# Altium project LimePSB-RPCM_1v2.PrjPcb (part 11 of 13)

## Sheet 13_Power.SchDoc: Power
size A3; Organization: Lime Microsystems; Address1: Surrey Tech Centre; Address2: Guildford GU2 7YG; Address3: Surrey; Address4: United Kingdom; Revision: v1.2; SheetNumber: 13; SheetTotal: 13
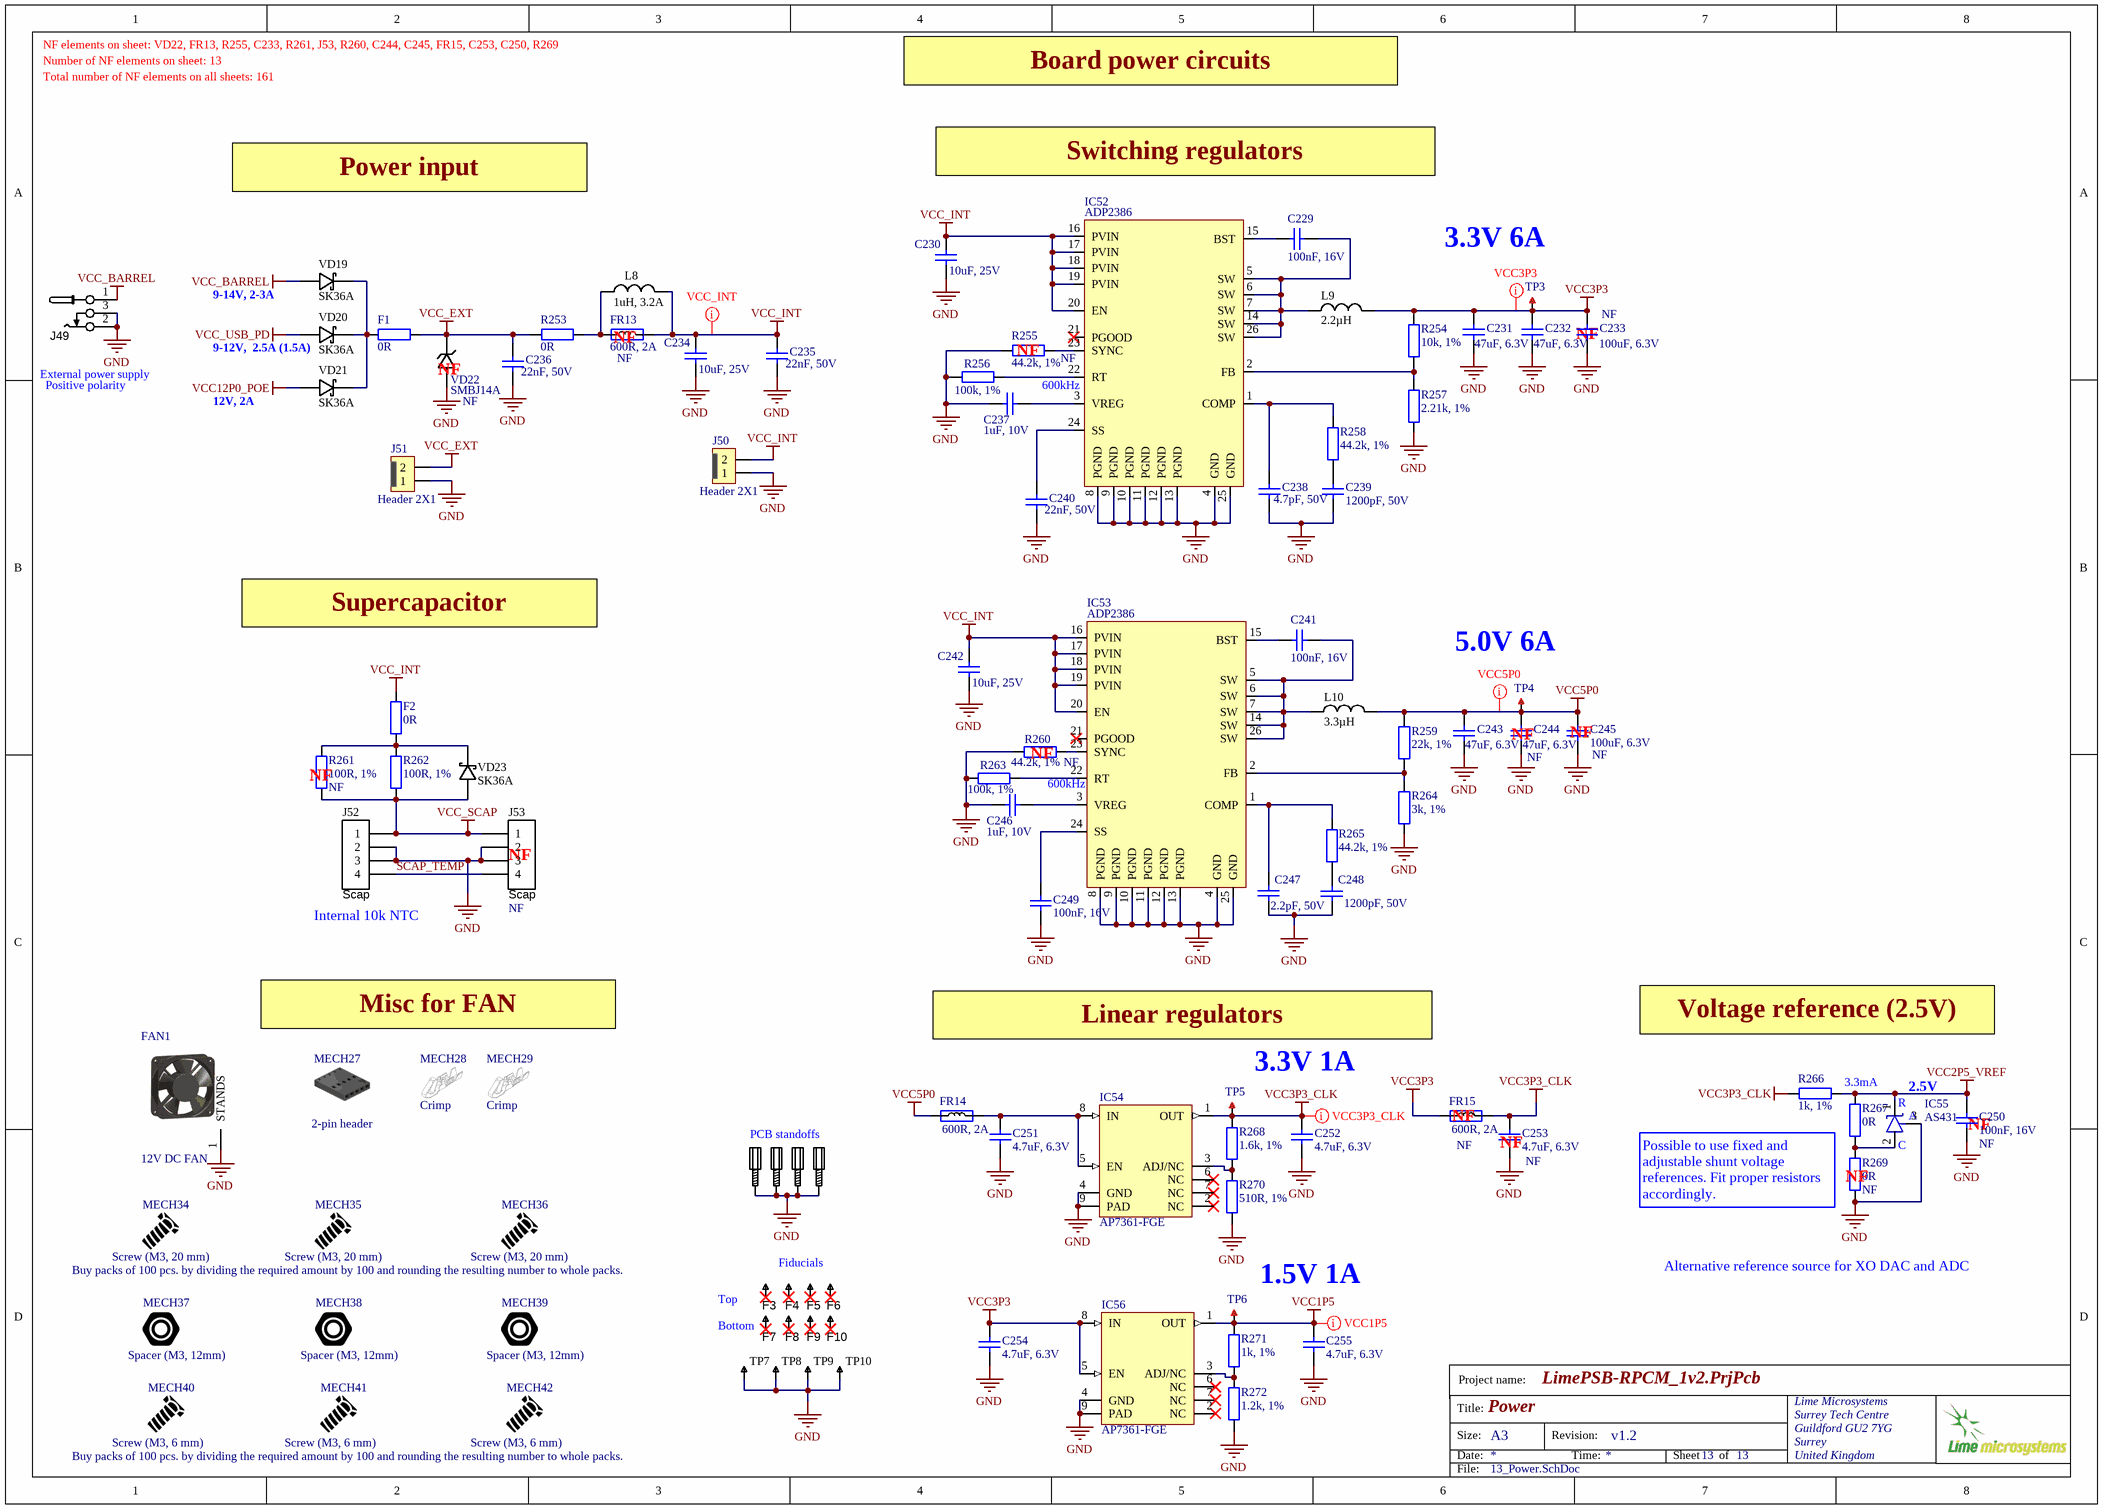
[diagram p12: 13_Power.SchDoc]

### Parts
C229  100nF, 16V  [CAP0402]
C230  10uF, 25V  [CAP0805]
C231  47uF, 6.3V  [CAP1206]
C232  47uF, 6.3V  [CAP1206]
C233  100uF, 6.3V  Assembly Info: NF  [CAP1206]
C234  10uF, 25V  [CAP0805]
C235  22nF, 50V  [CAP0402]
C236  22nF, 50V  [CAP0402]
C237  1uF, 10V  [CAP0402]
C238  4.7pF, 50V  [CAP0402]
C239  1200pF, 50V  [CAP0402]
C240  22nF, 50V  [CAP0402]
C241  100nF, 16V  [CAP0402]
C242  10uF, 25V  [CAP0805]
C243  47uF, 6.3V  [CAP1206]
C244  47uF, 6.3V  Assembly Info: NF  [CAP1206]
C245  100uF, 6.3V  Assembly Info: NF  [CAP1206]
C246  1uF, 10V  [CAP0402]
C247  2.2pF, 50V  [CAP0402]
C248  1200pF, 50V  [CAP0402]
C249  100nF, 16V  [CAP0402]
C250  100nF, 16V  Assembly Info: NF  [CAP0402]
C251  4.7uF, 6.3V  [CAP0402]
C252  4.7uF, 6.3V  [CAP0402]
C253  4.7uF, 6.3V  Assembly Info: NF  [CAP0402]
C254  4.7uF, 6.3V  [CAP0402]
C255  4.7uF, 6.3V  [CAP0402]
F1  0R  [RES0805]
F2  0R  [RES0805]
F3  Fiducial  [Fiducial]  (value not drawn)
F4  Fiducial  [Fiducial]  (value not drawn)
F5  Fiducial  [Fiducial]  (value not drawn)
F6  Fiducial  [Fiducial]  (value not drawn)
F7  Fiducial  [Fiducial]  (value not drawn)
F8  Fiducial  [Fiducial]  (value not drawn)
F9  Fiducial  [Fiducial]  (value not drawn)
F10  Fiducial  [Fiducial]  (value not drawn)
FAN1  12V DC FAN  [FAN_80mm_V1]
FR13  600R, 2A  Assembly Info: NF  [RES0805]
FR14  600R, 2A  [RES0805]
FR15  600R, 2A  Assembly Info: NF  [RES0805]
IC52  ADP2386  [ADP2386]
IC53  ADP2386  [ADP2386]
IC54  AP7361-FGE  [AP7361]
IC55  AS431  [SOT23-3_v2]
IC56  AP7361-FGE  [AP7361]
J49  CONN_PWR_JACK_2.1x5.5mm  [CONN_PWR_JACK_v2]  (value not drawn)
J50  Header 2X1  [Header1x2_TH_LOCKING]
J51  Header 2X1  [Header1x2_TH_LOCKING]
J52  Scap  [874370443_1P5_SMD_HEADER]
J53  Scap  Assembly Info: NF  [HEADER4X1_TH]
L8  1uH, 3.2A  [NRS4018T3R3MDGJ_inductor]
L9  2.2µH  [FDVE1040_TOKO_INDUCTOR]
L10  3.3µH  [FDVE1040_TOKO_INDUCTOR]
MECH27  2-pin header  (mechanical)
MECH28  Crimp  (mechanical)
MECH29  Crimp  (mechanical)
MECH30  # pcs.  [PCB_standoff]  (value not drawn)
MECH31  # pcs.  [PCB_standoff]  (value not drawn)
MECH32  # pcs.  [PCB_standoff]  (value not drawn)
MECH33  # pcs.  [PCB_standoff]  (value not drawn)
MECH34  Screw (M3, 20 mm)  (mechanical)
MECH35  Screw (M3, 20 mm)  Assembly Info: Buy packs of 100 pcs. by dividing the required amount by 100 and rounding the resulting number to whole packs.  (mechanical)
MECH36  Screw (M3, 20 mm)  (mechanical)
MECH37  Spacer (M3, 12mm)  (mechanical)
MECH38  Spacer (M3, 12mm)  (mechanical)
MECH39  Spacer (M3, 12mm)  (mechanical)
MECH40  Screw (M3, 6 mm)  (mechanical)
MECH41  Screw (M3, 6 mm)  Assembly Info: Buy packs of 100 pcs. by dividing the required amount by 100 and rounding the resulting number to whole packs.  (mechanical)
MECH42  Screw (M3, 6 mm)  (mechanical)
R253  0R  [RES0805]
R254  10k, 1%  [RES0402]
R255  44.2k, 1%  Assembly Info: NF  [RES0402]
R256  100k, 1%  [RES0402]
R257  2.21k, 1%  [RES0402]
R258  44.2k, 1%  [RES0402]
R259  22k, 1%  [RES0402]
R260  44.2k, 1%  Assembly Info: NF  [RES0402]
R261  100R, 1%  Assembly Info: NF  [RES0805]
R262  100R, 1%  [RES0805]
R263  100k, 1%  [RES0402]
R264  3k, 1%  [RES0402]
R265  44.2k, 1%  [RES0402]
R266  1k, 1%  [RES0402]
R267  0R  [RES0402]
R268  1.6k, 1%  [RES0402]
R269  0R  Assembly Info: NF  [RES0402]
R270  510R, 1%  [RES0402]
R271  1k, 1%  [RES0402]
R272  1.2k, 1%  [RES0402]
TP3  TESTPOINT_PAD  [TP_PAD_1p5MM]  (value not drawn)  (no BOM)
TP4  TESTPOINT_PAD  [TP_PAD_1p5MM]  (value not drawn)  (no BOM)
TP5  TESTPOINT_PAD  [TP_PAD_1p5MM]  (value not drawn)  (no BOM)
TP6  TESTPOINT_PAD  [TP_PAD_1p5MM]  (value not drawn)  (no BOM)
TP7  TESTPOINT_THT_MINI  [TP-SMD-LOW_PROFILE]  (value not drawn)
TP8  TESTPOINT_THT_MINI  [TP-SMD-LOW_PROFILE]  (value not drawn)
TP9  TESTPOINT_THT_MINI  [TP-SMD-LOW_PROFILE]  (value not drawn)
TP10  TESTPOINT_THT_MINI  [TP-SMD-LOW_PROFILE]  (value not drawn)
VD19  SK36A  [SK32A-L_DIODE_DO-214AC]
VD20  SK36A  [SK32A-L_DIODE_DO-214AC]
VD21  SK36A  [SK32A-L_DIODE_DO-214AC]
VD22  SMBJ14A  Assembly Info: NF  [SMAJ12CA-13-F]
VD23  SK36A  [SK32A-L_DIODE_DO-214AC]

### Nets
GND: C230.1 C231.1 C232.1 C233.1 C234.1 C235.2 C236.2 C237.2 C238.2 C239.2 C240.2 C242.1 C243.1 C244.1 C245.1 C246.2 C247.2 C248.2 C249.1 C250.1 C251.1 C252.1 C253.1 C254.1 C255.1 FAN1.1(STANDS) IC52.4(GND) IC52.8(PGND) IC52.9(PGND) IC52.10(PGND) IC52.11(PGND) IC52.12(PGND) IC52.13(PGND) IC52.25(GND) IC53.4(GND) IC53.8(PGND) IC53.9(PGND) IC53.10(PGND) IC53.11(PGND) IC53.12(PGND) IC53.13(PGND) IC53.25(GND) IC54.4(GND) IC54.9(PAD) IC55.3(NC/A) IC56.4(GND) IC56.9(PAD) J49.2 J49.3 J50.1 J51.1 J52.2 J52.3 J53.2 J53.3 MECH30.MH1 MECH31.MH1 MECH32.MH1 MECH33.MH1 R255.2 R256.2 R257.1 R260.2 R263.2 R264.1 R269.2 R270.2 R272.2 TP7.1 TP8.1 TP9.1 TP10.1 VD22.A
VCC1P5: C255.2 IC56.1(OUT) R271.2 TP6.1
VCC2P5_VREF: C250.2 IC55.1(K) R266.1 R267.1
VCC3P3: C231.2 C232.2 C233.2 C254.2 FR15.1 IC56.5(EN) IC56.8(IN) L9.2 R254.1 TP3.1
VCC3P3_CLK: C252.2 C253.2 FR15.2 IC54.1(OUT) R266.2 R268.2 TP5.1
VCC5P0: C243.2 C244.2 C245.2 FR14.1 L10.2 R259.2 TP4.1
VCC12P0_POE: VD21.A
VCC_BARREL: J49.1 VD19.A
VCC_EXT: C236.1 F1.1 J51.2 R253.2 VD22.K
VCC_INT: C230.2 C234.2 C235.1 C242.2 F2.1 FR13.2 IC52.16(PVIN) IC52.17(PVIN) IC52.18(PVIN) IC52.19(PVIN) IC52.20(EN) IC53.16(PVIN) IC53.17(PVIN) IC53.18(PVIN) IC53.19(PVIN) IC53.20(EN) J50.2 L8.2
VCC_SCAP: J52.1 J53.1 R261.2 R262.2 VD23.A
VCC_USB_PD: VD20.A
SCAP_TEMP: J52.4 J53.4
NetC229_1: C229.1 IC52.15(BST)
NetC229_2: C229.2 IC52.5(SW) IC52.6(SW) IC52.7(SW) IC52.14(SW) IC52.26(SW) L9.1
NetC237_1: C237.1 IC52.3(VREG)
NetC238_1: C238.1 IC52.1(COMP) R258.2
NetC239_1: C239.1 R258.1
NetC240_1: C240.1 IC52.24(SS)
NetC241_1: C241.1 IC53.15(BST)
NetC241_2: C241.2 IC53.5(SW) IC53.6(SW) IC53.7(SW) IC53.14(SW) IC53.26(SW) L10.1
NetC246_1: C246.1 IC53.3(VREG)
NetC247_1: C247.1 IC53.1(COMP) R265.2
NetC248_1: C248.1 R265.1
NetC249_2: C249.2 IC53.24(SS)
NetC251_2: C251.2 FR14.2 IC54.5(EN) IC54.8(IN)
NetF1_2: F1.2 VD19.K VD20.K VD21.K
NetF2_2: F2.2 R261.1 R262.1 VD23.K
NetFR13_1: FR13.1 L8.1 R253.1
NetIC52_2: IC52.2(FB) R254.2 R257.2
NetIC52_22: IC52.22(RT) R256.1
NetIC52_23: IC52.23(SYNC) R255.1
NetIC53_2: IC53.2(FB) R259.1 R264.2
NetIC53_22: IC53.22(RT) R263.1
NetIC53_23: IC53.23(SYNC) R260.1
NetIC54_3: IC54.3(ADJ/NC) R268.1 R270.1
NetIC55_2: IC55.2(A) R267.2 R269.1
NetIC56_3: IC56.3(ADJ/NC) R271.1 R272.1

Not connected (* = marked no-connect by the designer): F3 1*; F4 1*; F5 1*; F6 1*; F7 1*; F8 1*; F9 1*; F10 1*; IC52 21(PGOOD)*; IC53 21(PGOOD)*; IC54 2(NC)* 6(NC)* 7(NC)*; IC56 2(NC)* 6(NC)* 7(NC)*

### Layout directives
net class VCC1P5: VCC1P5
net class VCC3P3_CLK: VCC3P3_CLK
net class VCC3P3: VCC3P3
net class VCC_INT: VCC_INT
net class VCC5P0: VCC5P0

### Notes on the sheet
- NF elements on sheet: VD22, FR13, R255, C233, R261, J53, R260, C244, C245, FR15, C253, C250, R269
- Number of NF elements on sheet: 13
- Total number of NF elements on all sheets: 161
- Board power circuits
- Switching regulators
- Power input
- (near TP3) 3.3V 6A
- 9-14V, 2-3A
- (near J49) External power supply
- (near VD20) 9-12V,  2.5A (1.5A)
- (near VD22) NF
- (near FR13) NF
- (near R255) NF
- (near C233) NF
- (near J49) Positive polarity
- 12V, 2A
- (near IC52) 600kHz
- Supercapacitor
- (near TP4) 5.0V 6A
- (near R261) NF
- (near R260) NF
- (near IC53) 600kHz
- (near C244) NF
- (near C245) NF
- (near J53) NF
- (near J52) Internal 10k NTC
- Misc for FAN
- Linear regulators
- Voltage reference (2.5V)
- 3.3V 1A
- (near FR15) NF
- 3.3mA
- (near IC55) R
- (near IC55) A
- 2.5V
- PCB standoffs
- (near C253) NF
- (near R269) NF
- (near IC55) C
- (near C250) NF
- Possible to use fixed and adjustable shunt voltage references. Fit proper resistors accordingly.
- Top
- (near F7) Bottom
- Fiducials
- 1.5V 1A
- Alternative reference source for XO DAC and ADC
- Project name:
- Title:
- Size:
- Date:
- A3
- Revision:
- Time:
- Sheet
- of
- File: